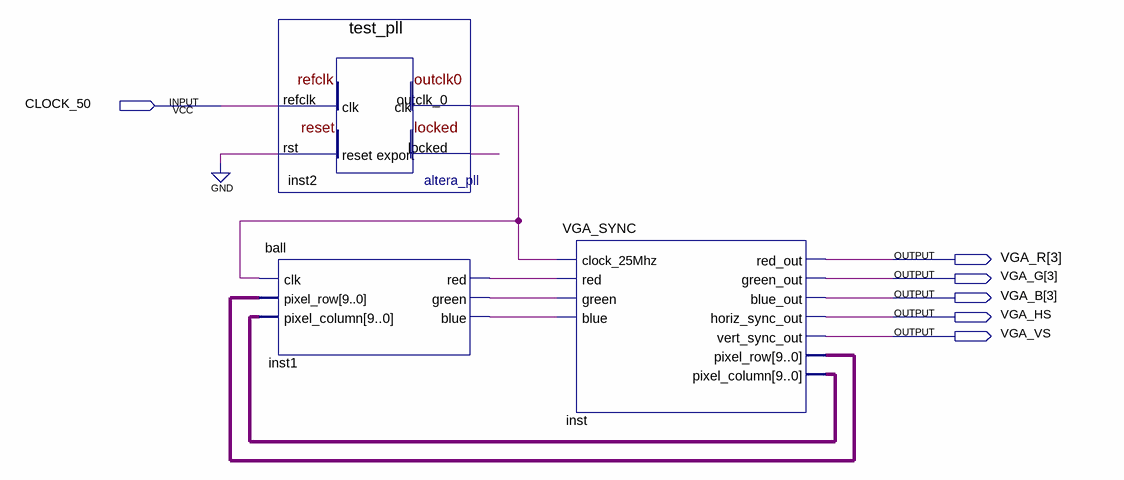
[diagram p0: schematic sheet]
// Quartus schematic BallTest.bdf as structural Verilog: 3 symbols, 6 pins
module BallTest (
  input  CLOCK_50,
  output [3:3] VGA_R,
  output [3:3] VGA_G,
  output [3:3] VGA_B,
  output VGA_HS,
  output VGA_VS
);

  wire inst1_blue, inst1_green, inst1_red, inst2_locked, inst2_outclk_0;
  wire [9:0] inst_pixel_column, inst_pixel_row;

  test_pll inst2 (.refclk(CLOCK_50), .rst(1'b0), .outclk_0(inst2_outclk_0), .locked(inst2_locked));
  ball inst1 (
    .clk(inst2_outclk_0), .pixel_row(inst_pixel_row), .pixel_column(inst_pixel_column), .red(inst1_red),
    .green(inst1_green), .blue(inst1_blue));
  VGA_SYNC inst (
    .clock_25Mhz(inst2_outclk_0), .red(inst1_red), .green(inst1_green), .blue(inst1_blue),
    .red_out(VGA_R[3]), .green_out(VGA_G[3]), .blue_out(VGA_B[3]), .horiz_sync_out(VGA_HS),
    .vert_sync_out(VGA_VS), .pixel_row(inst_pixel_row), .pixel_column(inst_pixel_column));
endmodule
